# Altium project STM_BLUEPILL.PrjPcb
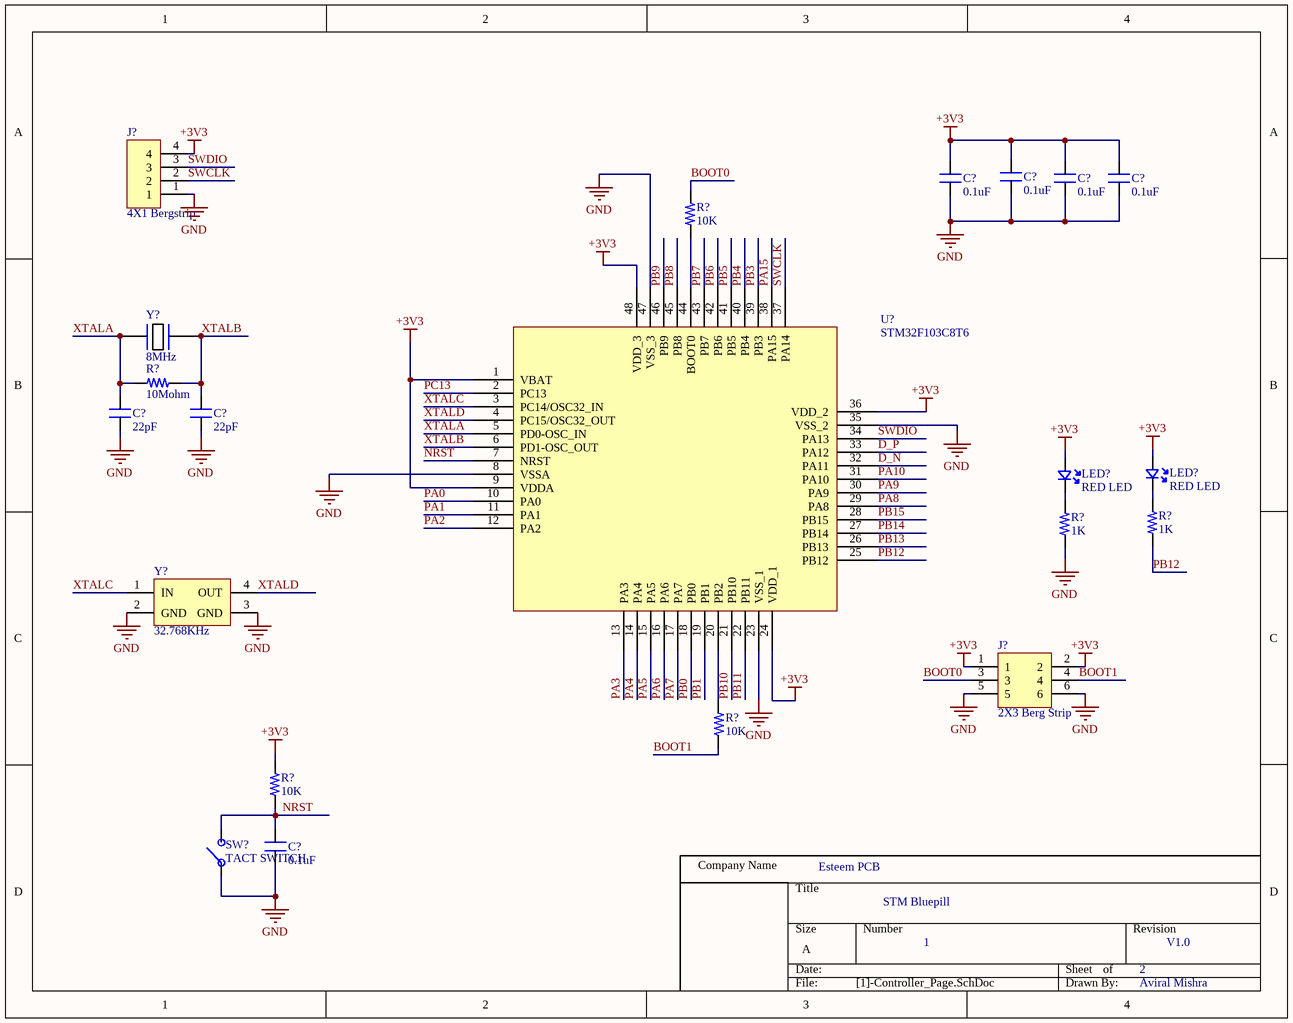
[diagram p0: [1]-Controller_Page.SchDoc]
2 sheets, 29 parts. Net scope: global (net labels, ports and power ports of the same name join across sheets).
Board file: STM_BLUEPILL.PcbDoc
Sheets:
  [1]-Controller_Page.SchDoc
  [2]- Connector_Page.SchDoc

## Sheet [1]-Controller_Page.SchDoc: STM Bluepill
size A; DrawnBy: Aviral Mishra; DocumentNumber: 1; Revision: V1.0; SheetNumber: 1; SheetTotal: 2; Company Name: Esteem PCB

### Parts
(Parts that share a designator on the sheet are numbered #1, #2 ... from top to bottom, then left to right.)
C?#1  0.1uF  [CAP_0805]
C?#2  0.1uF  [CAP_0805]
C?#3  0.1uF  [CAP_0805]
C?#4  0.1uF  [CAP_0805]
C?#5  22pF  [CAP_0805]
C?#6  22pF  [CAP_0805]
C?#7  0.1uF  [CAP_0805]
J?#1  4X1 Bergstrip  [CON4_100_40D72_TH_ST_MALE]
J?#2  2X3 Berg Strip  [CON6_100_59D78_TH_ST_Duplicate]
LED?#1  RED LED  [LED_0805]
LED?#2  RED LED  [LED_0805]
R?#1  10K  [RES_0805]
R?#2  10Mohm  [RES_0805]
R?#3  1K  [RES_0805]
R?#4  1K  [RES_0805]
R?#5  10K  [RES_0805]
R?#6  10K  [RES_0805]
SW?  TACT SWITCH  [SW_342_SMD]
U?  STM32F103C8T6  [LQFP-48_19.6_393_58X11_SMD]
Y?#1  8MHz  [XTAL_314_240X47_SMD]
Y?#2  32.768KHz  [XTAL_MC-405 32.7680K-G3]

### Nets
+3V3: C?#1.2 C?#2.2 C?#3.2 C?#4.2 J?#1.4 J?#2.1 J?#2.2 LED?#1.A LED?#2.A R?#6.2 U?.1(VBAT) U?.9(VDDA) U?.24(VDD_1) U?.36(VDD_2) U?.48(VDD_3)
GND: C?#1.1 C?#2.1 C?#3.1 C?#4.1 C?#5.1 C?#6.1 C?#7.1 J?#1.1 J?#2.5 J?#2.6 R?#3.1 SW?.1 U?.8(VSSA) U?.23(VSS_1) U?.35(VSS_2) U?.47(VSS_3) Y?#2.2(GND) Y?#2.3(GND)
BOOT0: J?#2.3 R?#1.2
BOOT1: J?#2.4 R?#5.2
D_N: U?.32(PA11)
D_P: U?.33(PA12)
NRST: C?#7.2 R?#6.1 SW?.2 U?.7(NRST)
PA0: U?.10(PA0)
PA1: U?.11(PA1)
PA2: U?.12(PA2)
PA3: U?.13(PA3)
PA4: U?.14(PA4)
PA5: U?.15(PA5)
PA6: U?.16(PA6)
PA7: U?.17(PA7)
PA8: U?.29(PA8)
PA9: U?.30(PA9)
PA10: U?.31(PA10)
PA15: U?.38(PA15)
PB0: U?.18(PB0)
PB1: U?.19(PB1)
PB3: U?.39(PB3)
PB4: U?.40(PB4)
PB5: U?.41(PB5)
PB6: U?.42(PB6)
PB7: U?.43(PB7)
PB8: U?.45(PB8)
PB9: U?.46(PB9)
PB10: U?.21(PB10)
PB11: U?.22(PB11)
PB12: R?#4.1 U?.25(PB12)
PB13: U?.26(PB13)
PB14: U?.27(PB14)
PB15: U?.28(PB15)
PC13: U?.2(PC13)
SWCLK: J?#1.2 U?.37(PA14)
SWDIO: J?#1.3 U?.34(PA13)
XTALA: C?#5.2 R?#2.1 U?.5(PD0-OSC_IN) Y?#1.1
XTALB: C?#6.2 R?#2.2 U?.6(PD1-OSC_OUT) Y?#1.2
XTALC: U?.3(PC14/OSC32_IN) Y?#2.1(IN)
XTALD: U?.4(PC15/OSC32_OUT) Y?#2.4(OUT)
NetLED?#1_K: LED?#1.K R?#3.2
NetLED?#2_K: LED?#2.K R?#4.2
NetR?#1_1: R?#1.1 U?.44(BOOT0)
NetR?#5_1: R?#5.1 U?.20(PB2)

### Notes on the sheet
- Company Name

### Library data of the parts
C?#1-C?#4 C?#7 = CAP_0.1uF-50V-5%-0805: 0.1µF ±5% 50V Ceramic Capacitor X7R 0805 (2012 Metric); Manufacturer: KEMET; Manufacturing Part Number: C0805C104J5RACTU; Case/Package: 0805 (2012 Metric); Supplier-1: Digikey; Supplier Part Number-1: 399-1171-1-ND
C?#5 C?#6 = CAP_22pF-50V-5%-0805: 22pF ±5% 50V Ceramic Capacitor C0G, NP0 0805 (2012 Metric); Manufacturer: KEMET; Manufacturer Part Number: C0805C220J5GACTU; Case/Package: 0805; Supplier-1: Digikey; Supplier Part Number-1: 399-1113-1-ND
J?#1 = CON-BS-PLG_4X1-100-TH-ST: 4 pin, 1 row, 2.54mm pitch bergstrip; Manufacturer: NA; Manufacturing Part Number: NA; Case/Package: TH; Supplier-1: NA; Supplier Part Number-1: NA
J?#2 = CON-BS-PLG_2X3-100-TH-ST: 6 pin, 2 row, 2.54mm pitch bergstrip; Manufacturer: NA; Manufacturer Part Number: NA; Case/Package: TH; Supplier-1: NA; Supplier Part Number-1: NA
LED?#1 LED?#2 = LED-RED_10mA-0805: Red 621nm LED Indication - Discrete 2V 0805 (2012 Metric); Manufacturer: Lite-On Inc.; Manufacturer Part Number: LTST-C170EKT; Case/ Package: 0805; Supplier-1: Digikey; Supplier Part Number-1: 160-1178-1-ND
R?#1 R?#5 R?#6 = RES_10K-0.125W-1%-0805: 10 kOhms ±1% 0.125W, 1/8W Chip Resistor 0805 (2012 Metric) Moisture Resistant Thick Film; Manufacturer: Yageo; Manufacturing Part Number: RC0805FR-0710KL; Case/Package: 0805; Supplier-1: Digikey; Supplier Part Number-1: 311-10.0KCRCT-ND
R?#2 = RES_10MOHM-0.125W-1%-0805: 10 MOhms ±1% 0.125W, 1/8W Chip Resistor 0805 (2012 Metric) Automotive AEC-Q200, High Voltage Thick Film; Manufacturer: Rohm Semiconductor; Manufacturing Part Number: KTR10EZPF1005; Case/Package: 0805 (2012 Metric); Supplier-1: Digikey; Supplier Part Number-1: RHM10.0MAHCT-ND
R?#3 R?#4 = RES_1K-0.125W-1%-0805: 1 kOhms ±1% 0.125W, 1/8W Chip Resistor 0805 (2012 Metric) Moisture Resistant Thick Film; Manufacturer: 垈㎵á; Manufacturer Part Number: RC0805FR-071KL; Case/Package: 0805; Supplier-1: Digikey; Supplier Part Number-1: 311-1.00KCRCT-ND
SW? = SW_KSR223GLFG-SMD: Tactile Switch SPST-NO Top Actuated Surface Mount; Manufacturer: C&K; Manufacturing Part Number: KSR223GLFG; Case/Package: SMD; Supplier-1: Digikey; Supplier Part Number-1: 401-1704-1-ND
U? = IC-STM32F103C8T6 _1: ARM® Cortex®-M3 STM32F1 Microcontroller IC 32-Bit 72MHz 64KB (64K x 8) FLASH /; Manufacturer: STMicroelectronics; Manufacturer Part Number: STM32F103C8T6; Case/Package: 48-LQFP; Supplier-1: Digikey; Supplier Part Number-1: 497-6063-ND
Y?#1 = XTAL_8MHZ-LFXTAL030234: Crystals 8MHz 22pF -20C 70C; Manufacturer: IQD Frequency Products; Manufacturing Part Number: LFXTAL030234Reel; Case/Package: SMD; Supplier-1: Mouser; Supplier Part Number-1: 449-LFXTAL030234REEL
Y?#2 = XTAL_32.768KHz-MC-405 32.7680K-G3: Crystals SMD AT XTL MHZ +/-50PPM 12.5 PF 250 T/R; Manufacturer: Epson; Manufacturing Part Number: MC-405 32.7680K-G3: ROHS; Case/Package: SMD; Supplier-1: Mouser; Supplier Part Number-1: 732-MC405327680KG3RS

## Sheet [2]- Connector_Page.SchDoc: STM Bluepill
size A; DrawnBy: Aviral Mishra; DocumentNumber: 2; Revision: V1.0; SheetNumber: 2; SheetTotal: 2; Company Name: Esteem PCB
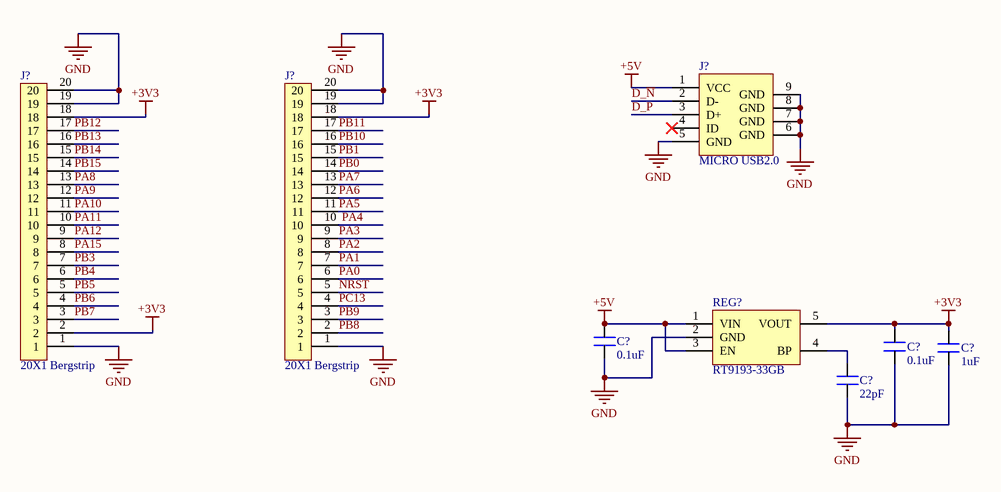
[diagram p1: [2]- Connector_Page.SchDoc]

### Parts
(Parts that share a designator on the sheet are numbered #1, #2 ... from top to bottom, then left to right.)
C?#8  0.1uF  [CAP_0805]
C?#9  0.1uF  [CAP_0805]
C?#10  1uF  [CAP_0805]
C?#11  22pF  [CAP_0805]
J?#3  MICRO USB2.0  [CON_10118192-0001LF_SMD]
J?#4  20X1 Bergstrip  [CON20_100_40D72_TH_ST]
J?#5  20X1 Bergstrip  [CON20_100_40D72_TH_ST]
REG?  RT9193-33GB  [SOT23-5]

### Nets
+3V3: C?#9.2 C?#10.2 J?#4.2 J?#4.18 J?#5.18 REG?.5(VOUT)
+5V: C?#8.2 J?#3.1(VCC) REG?.1(VIN) REG?.3(EN)
GND: C?#8.1 C?#9.1 C?#10.1 C?#11.1 J?#3.5(GND) J?#3.6(GND) J?#3.7(GND) J?#3.8(GND) J?#3.9(GND) J?#4.1 J?#4.19 J?#4.20 J?#5.1 J?#5.19 J?#5.20 REG?.2(GND)
D_~{N}: J?#3.2(D-)
D_P: J?#3.3(D+)
NRST: J?#5.5
PA0: J?#5.6
PA1: J?#5.7
PA2: J?#5.8
PA3: J?#5.9
PA4: J?#5.10
PA5: J?#5.11
PA6: J?#5.12
PA7: J?#5.13
PA8: J?#4.13
PA9: J?#4.12
PA10: J?#4.11
PA11: J?#4.10
PA12: J?#4.9
PA15: J?#4.8
PB0: J?#5.14
PB1: J?#5.15
PB3: J?#4.7
PB4: J?#4.6
PB5: J?#4.5
PB6: J?#4.4
PB7: J?#4.3
PB8: J?#5.2
PB9: J?#5.3
PB10: J?#5.16
PB11: J?#5.17
PB12: J?#4.17
PB13: J?#4.16
PB14: J?#4.15
PB15: J?#4.14
PC13: J?#5.4
NetC?#11_2: C?#11.2 REG?.4(BP)

Not connected (* = marked no-connect by the designer): J?#3 4(ID)*

### Notes on the sheet
- Company Name

### Library data of the parts
C?#8 C?#9 = CAP_0.1uF-50V-5%-0805: as C?#1 on sheet [1]-Controller_Page; Case/Package: 0805 (2012 Metric); Supplier-1: Digikey; Supplier Part Number-1: 399-1171-1-ND
C?#10 = CAP_1uF-50V-5%-0805: 1µF ±5% 50V Ceramic Capacitor X7R 0805 (2012 Metric); Manufacturer: Yageo; Manufacturing Part Number: CC0805JKX7R9BB105; Case/Package: 0805 (2012 Metric); Supplier-1: Digikey; Supplier Part Number-1: 311-3498-1-ND
C?#11 = CAP_22pF-50V-5%-0805: as C?#5 on sheet [1]-Controller_Page; Case/Package: 0805; Supplier-1: Digikey; Supplier Part Number-1: 399-1113-1-ND
J?#3 = CON-USB_10118192-0002LF-SMD: USB - micro B USB 2.0 Receptacle Connector 5 Position Surface Mount, Right Angle; Manufacturer: Amphenol ICC (FCI); Manufacturing Part Number: 10118192-0002LF; Case/Package: SMD; Supplier-1: Digikey; Supplier Part Number-1: 609-5379-1-ND
J?#4 J?#5 = CON-BS-PLG_20X1-100-TH-ST: 20 pin, 1 row, 2.54mm pitch bergstrip; Manufacturer: NA; Manufacturing Part Number: NA; Case/Package: TH; Supplier-1: NA; Supplier Part Number-1: NA
REG? = REG_3.3V-5.5V-0.3A-SOT-23-5: Linear Voltage Regulator IC 1 Output 300mA SOT-23-5; Manufacturer: Richtek USA Inc.; Manufacturer Part Number: RT9193-33GB; Case/ Package: SOT-23-5; Supplier-1: Digikey; Supplier Part Number-1: 1028-1014-1-ND

## Nets that join several sheets
+3V3: [1]-Controller_Page (15 pins), [2]- Connector_Page (6 pins)
GND: [1]-Controller_Page (18 pins), [2]- Connector_Page (16 pins)
D_P: [1]-Controller_Page (U?.33), [2]- Connector_Page (J?#3.3)
NRST: [1]-Controller_Page (C?#7.2 R?#6.1 SW?.2 U?.7), [2]- Connector_Page (J?#5.5)
PA0: [1]-Controller_Page (U?.10), [2]- Connector_Page (J?#5.6)
PA1: [1]-Controller_Page (U?.11), [2]- Connector_Page (J?#5.7)
PA2: [1]-Controller_Page (U?.12), [2]- Connector_Page (J?#5.8)
PA3: [1]-Controller_Page (U?.13), [2]- Connector_Page (J?#5.9)
PA4: [1]-Controller_Page (U?.14), [2]- Connector_Page (J?#5.10)
PA5: [1]-Controller_Page (U?.15), [2]- Connector_Page (J?#5.11)
PA6: [1]-Controller_Page (U?.16), [2]- Connector_Page (J?#5.12)
PA7: [1]-Controller_Page (U?.17), [2]- Connector_Page (J?#5.13)
PA8: [1]-Controller_Page (U?.29), [2]- Connector_Page (J?#4.13)
PA9: [1]-Controller_Page (U?.30), [2]- Connector_Page (J?#4.12)
PA10: [1]-Controller_Page (U?.31), [2]- Connector_Page (J?#4.11)
PA15: [1]-Controller_Page (U?.38), [2]- Connector_Page (J?#4.8)
PB0: [1]-Controller_Page (U?.18), [2]- Connector_Page (J?#5.14)
PB1: [1]-Controller_Page (U?.19), [2]- Connector_Page (J?#5.15)
PB3: [1]-Controller_Page (U?.39), [2]- Connector_Page (J?#4.7)
PB4: [1]-Controller_Page (U?.40), [2]- Connector_Page (J?#4.6)
PB5: [1]-Controller_Page (U?.41), [2]- Connector_Page (J?#4.5)
PB6: [1]-Controller_Page (U?.42), [2]- Connector_Page (J?#4.4)
PB7: [1]-Controller_Page (U?.43), [2]- Connector_Page (J?#4.3)
PB8: [1]-Controller_Page (U?.45), [2]- Connector_Page (J?#5.2)
PB9: [1]-Controller_Page (U?.46), [2]- Connector_Page (J?#5.3)
PB10: [1]-Controller_Page (U?.21), [2]- Connector_Page (J?#5.16)
PB11: [1]-Controller_Page (U?.22), [2]- Connector_Page (J?#5.17)
PB12: [1]-Controller_Page (R?#4.1 U?.25), [2]- Connector_Page (J?#4.17)
PB13: [1]-Controller_Page (U?.26), [2]- Connector_Page (J?#4.16)
PB14: [1]-Controller_Page (U?.27), [2]- Connector_Page (J?#4.15)
PB15: [1]-Controller_Page (U?.28), [2]- Connector_Page (J?#4.14)
PC13: [1]-Controller_Page (U?.2), [2]- Connector_Page (J?#5.4)